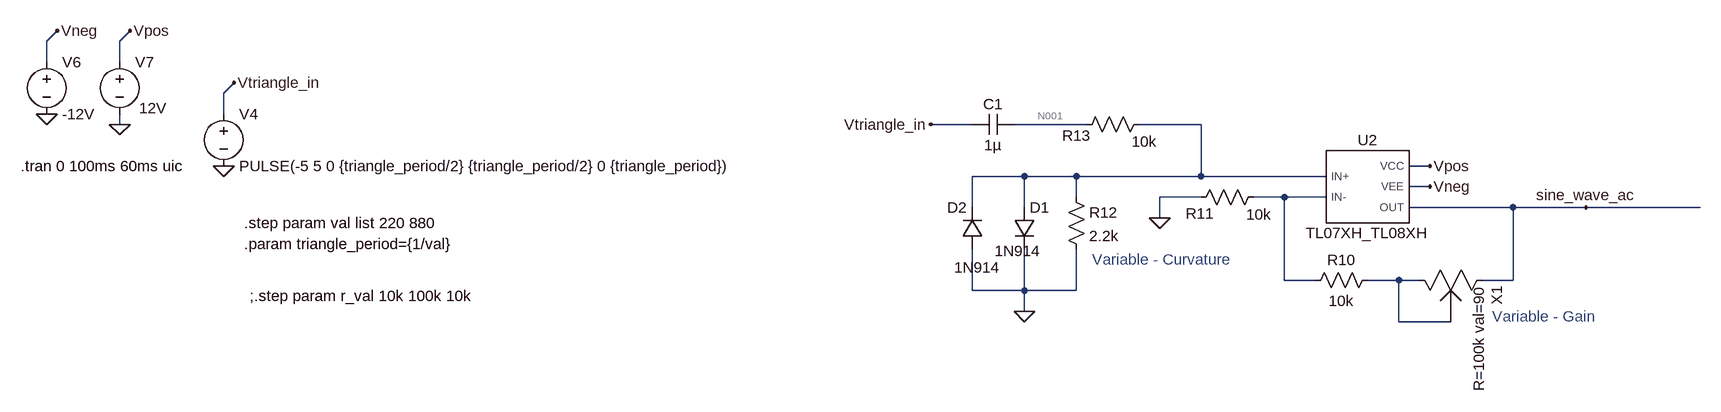
[diagram p0: schematic main_TRIAN_to_SINE2.asc]
main_TRIAN_to_SINE2.asc, the LTspice schematic file:
Version 4
SHEET 1 3072 1764
WIRE -3440 -496 -3424 -512
WIRE -3328 -496 -3312 -512
WIRE -3440 -464 -3440 -496
WIRE -3328 -464 -3328 -496
WIRE -3168 -416 -3152 -432
WIRE -3168 -384 -3168 -416
WIRE -3328 -368 -3328 -384
WIRE -2016 -368 -2080 -368
WIRE -1840 -368 -1952 -368
WIRE -1664 -368 -1760 -368
WIRE -1312 -304 -1344 -304
WIRE -1936 -288 -2016 -288
WIRE -1856 -288 -1936 -288
WIRE -1664 -288 -1664 -368
WIRE -1664 -288 -1856 -288
WIRE -1472 -288 -1664 -288
WIRE -1312 -272 -1344 -272
WIRE -1856 -256 -1856 -288
WIRE -1664 -256 -1728 -256
WIRE -1536 -256 -1584 -256
WIRE -1472 -256 -1536 -256
WIRE -2016 -240 -2016 -288
WIRE -1936 -240 -1936 -288
WIRE -1184 -240 -1344 -240
WIRE -1072 -240 -1184 -240
WIRE -896 -240 -1072 -240
WIRE -1728 -224 -1728 -256
WIRE -1536 -128 -1536 -256
WIRE -1488 -128 -1536 -128
WIRE -1360 -128 -1408 -128
WIRE -1328 -128 -1360 -128
WIRE -1184 -128 -1184 -240
WIRE -1184 -128 -1232 -128
WIRE -2016 -112 -2016 -176
WIRE -1936 -112 -1936 -176
WIRE -1936 -112 -2016 -112
WIRE -1856 -112 -1856 -176
WIRE -1856 -112 -1936 -112
WIRE -1936 -80 -1936 -112
WIRE -1360 -64 -1360 -128
WIRE -1280 -64 -1360 -64
FLAG -3440 -384 0
FLAG -3328 -368 0
FLAG -3424 -512 Vneg
FLAG -3312 -512 Vpos
FLAG -3168 -304 0
FLAG -3152 -432 Vtriangle_in
FLAG -1312 -304 Vpos
FLAG -1312 -272 Vneg
FLAG -1728 -224 0
FLAG -1936 -80 0
FLAG -2080 -368 Vtriangle_in
FLAG -1072 -240 sine_wave_ac
SYMBOL voltage -3440 -480 R0
WINDOW 123 0 0 Left 0
WINDOW 39 0 0 Left 0
SYMATTR InstName V6
SYMATTR Value -12V
SYMBOL voltage -3328 -480 R0
WINDOW 123 0 0 Left 0
WINDOW 39 0 0 Left 0
WINDOW 3 30 87 Left 2
SYMATTR Value 12V
SYMATTR InstName V7
SYMBOL voltage -3168 -400 R0
WINDOW 123 0 0 Left 0
WINDOW 39 0 0 Left 0
SYMATTR InstName V4
SYMATTR Value PULSE(-5 5 0 {triangle_period/2} {triangle_period/2} 0 {triangle_period})
SYMBOL TL07XH_TL08XH -1408 -272 R0
SYMATTR InstName U2
SYMBOL diode -1952 -240 R0
WINDOW 3 -30 67 Left 2
SYMATTR Value 1N914
SYMATTR InstName D1
SYMBOL diode -2000 -176 R180
WINDOW 0 24 64 Left 2
WINDOW 3 -27 -28 Left 2
SYMATTR InstName D2
SYMATTR Value 1N914
SYMBOL res -1504 -112 R270
WINDOW 0 32 56 VTop 2
WINDOW 3 0 56 VBottom 2
SYMATTR InstName R10
SYMATTR Value 10k
SYMBOL res -1680 -240 R270
WINDOW 0 -25 14 VTop 2
WINDOW 3 5 105 VBottom 2
SYMATTR InstName R11
SYMATTR Value 10k
SYMBOL res -1872 -272 R0
SYMATTR InstName R12
SYMATTR Value 2.2k
SYMBOL res -1856 -352 R270
WINDOW 0 -17 0 VTop 2
WINDOW 3 5 105 VBottom 2
SYMATTR InstName R13
SYMATTR Value 10k
SYMBOL cap -1952 -384 R90
WINDOW 0 0 32 VBottom 2
WINDOW 3 32 32 VTop 2
SYMATTR InstName C1
SYMATTR Value 1µ
SYMBOL pot -1216 -144 R90
WINDOW 0 25 -7 Left 2
WINDOW 39 25 21 Left 2
SYMATTR InstName X1
SYMATTR SpiceLine R=100k val=90
TEXT -3480 -304 Left 2 !.tran 0 100ms 60ms uic
TEXT -3136 -184 Left 2 !.param triangle_period={1/val}
TEXT -3136 -216 Left 2 !.step param val list 220 880
TEXT -3128 -104 Left 2 !;.step param r_val 10k 100k 10k
TEXT -1216 -72 Left 2 ;Variable - Gain
TEXT -1832 -160 Left 2 ;Variable - Curvature

The netlist it stands for:
* main_TRIAN_to_SINE2.asc
V6 Vneg 0 -12V
V7 Vpos 0 12V
V4 Vtriangle_in 0 PULSE(-5 5 0 {triangle_period/2} {triangle_period/2} 0 {triangle_period})
XU2 N002 N003 Vpos Vneg sine_wave_ac TL07XH_TL08XH  ; pins IN+ IN- VCC VEE OUT
D1 N002 0 1N914
D2 0 N002 1N914
R10 N003 N004 10k
R11 0 N003 10k
R12 N002 0 2.2k
R13 N001 N002 10k
C1 N001 Vtriangle_in 1µ
XX1 sine_wave_ac N004 N004 pot R=100k val=90  ; pins 1 3 2
.model D D
.lib standard.dio
.tran 0 100ms 60ms uic
.param triangle_period={1/val}
.step param val list 220 880
;.step param r_val 10k 100k 10k
* Variable - Gain
* Variable - Curvature
.lib C:\HOME_projects\SYNTH_GOOM\2LineartoExponential\tl07xh_tl08xh.lib
.backanno
.end

* Results of the author's LTspice run, read from the files saved beside the schematic
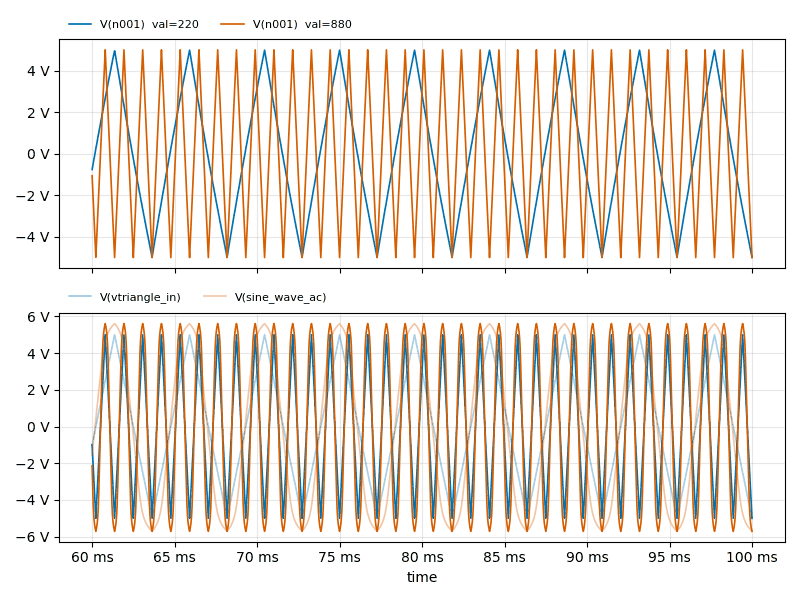
[diagram p1: Transient Analysis of main_TRIAN_to_SINE2.asc, plotted from the saved traces]
* Transient Analysis, 2 runs:
*   V(n001) [val=220]: min -4.984 V, max 4.984 V, average 64.56 mV, rms 2.879 V, last -4.984 V
*   V(n001) [val=880]: min -4.999 V, max 4.999 V, average -17.25 mV, rms 2.892 V, last -4.999 V
*   V(vtriangle_in) [val=220]: min -5 V, max 5 V, average 68.18 mV, rms 2.882 V, last -5 V
*   V(vtriangle_in) [val=880]: min -5 V, max 5 V, average -17.05 mV, rms 2.892 V, last -5 V
*   V(sine_wave_ac) [val=220]: min -5.705 V, max 5.608 V, average 50.23 mV, rms 4.188 V, last -5.705 V
*   V(sine_wave_ac) [val=880]: min -5.708 V, max 5.61 V, average -74.73 mV, rms 4.202 V, last -5.708 V